# Altium schematic sheet power_io.SchDoc: Power & I/O
size A3; SheetNumber: 6; SheetTotal: 11
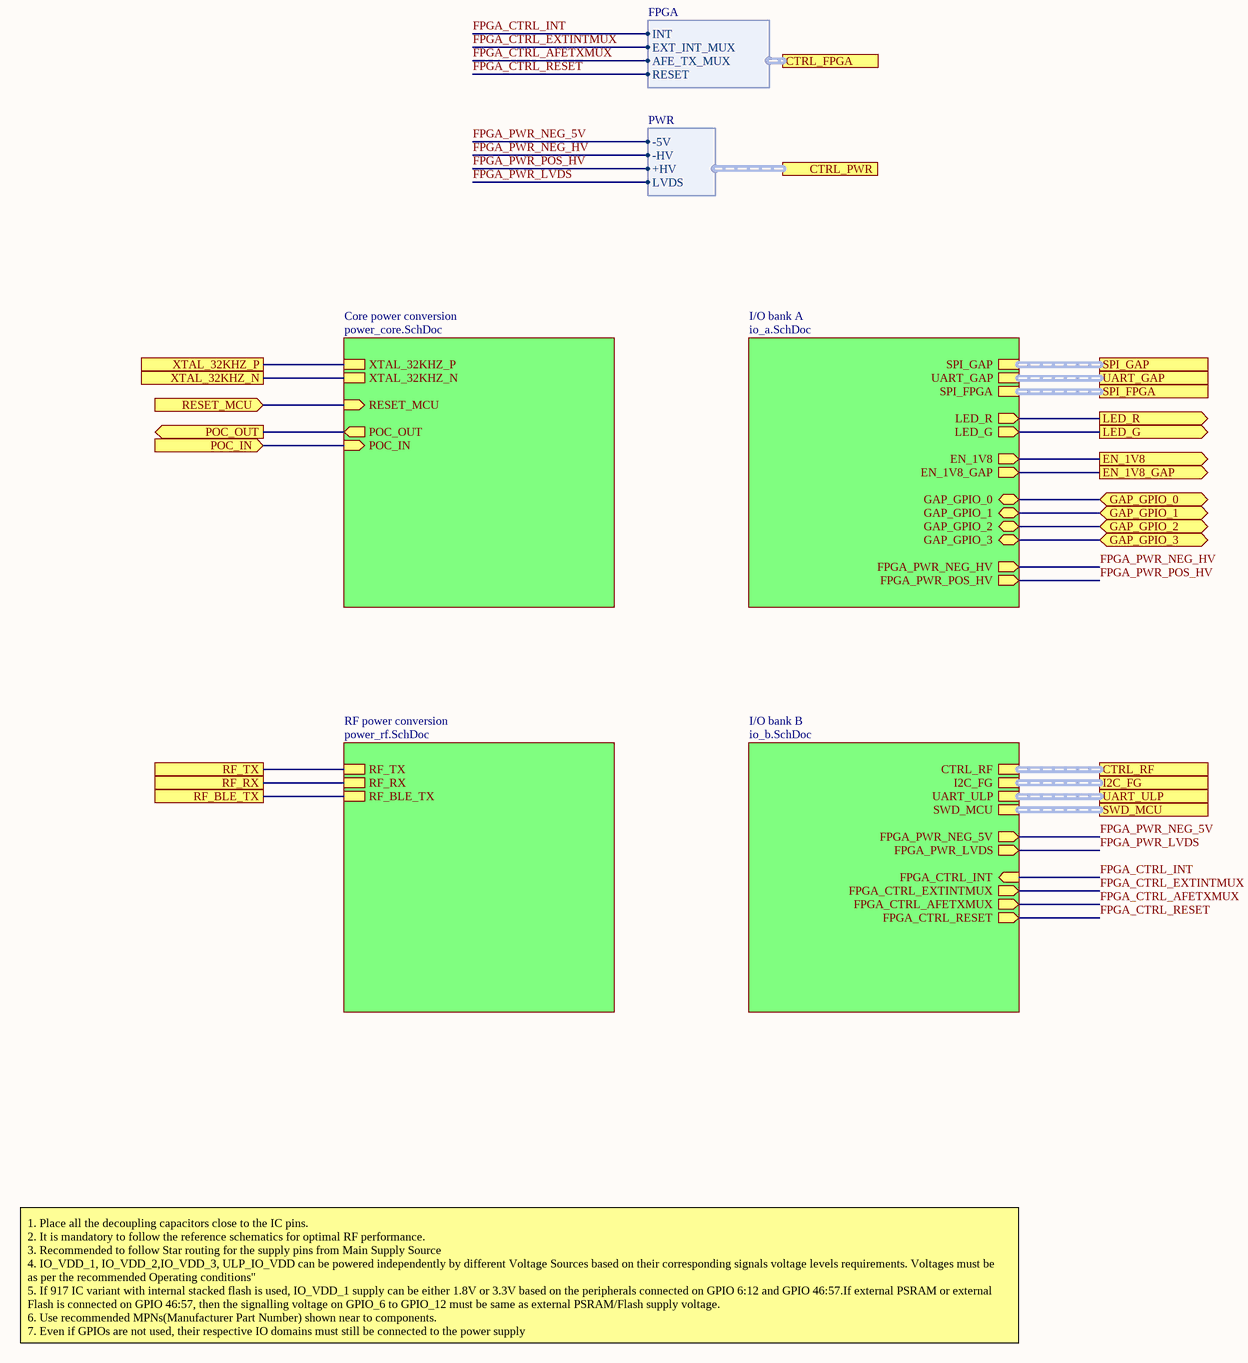
[diagram p0: power_io.SchDoc]

## Sub-sheets
Core power conversion = power_core.SchDoc: XTAL_32KHZ_P, XTAL_32KHZ_N, RESET_MCU (in), POC_OUT (out), POC_IN (in)
I/O bank A = io_a.SchDoc: SPI_GAP (harness SPI), UART_GAP (harness UART), SPI_FPGA (harness SPI), LED_R (out), LED_G (out), EN_1V8 (out), GAP_GPIO_0 (bidir), GAP_GPIO_1 (bidir), GAP_GPIO_2 (bidir), GAP_GPIO_3 (bidir), FPGA_PWR_NEG_HV (out), FPGA_PWR_POS_HV (out), EN_1V8_GAP (out)
I/O bank B = io_b.SchDoc: CTRL_RF (harness RF), I2C_FG (harness I2C), UART_ULP (harness UART), SWD_MCU (harness SWD), FPGA_CTRL_INT (in), FPGA_CTRL_EXTINTMUX (out), FPGA_CTRL_AFETXMUX (out), FPGA_CTRL_RESET (out), FPGA_PWR_NEG_5V (out), FPGA_PWR_LVDS (out)
RF power conversion = power_rf.SchDoc: RF_TX, RF_RX, RF_BLE_TX

## Ports
CTRL_FPGA (harness FPGA, see main[4B], connectors[4C]), CTRL_PWR (harness PWR, see main[4B], connectors[2C]), CTRL_RF (harness RF, see main[5A], io_b[4B], rf_clocks[1C]), EN_1V8 (out, see main[4C], io_a[3B], power_conversion[1B]), EN_1V8_GAP (out, see main[4C], io_a[3B]), GAP_GPIO_0 (bidir, see main[5B], gap[3C], io_a[3B]), GAP_GPIO_1 (bidir, see main[5B], gap[3C], io_a[3B]), GAP_GPIO_2 (bidir, see main[5B], gap[3C], io_a[3B]), GAP_GPIO_3 (bidir, see main[5B], gap[3C], io_a[3B]), I2C_FG (harness I2C, see main[4B], connectors[2B], io_b[4B], power_conversion[1A]), LED_G (out, see main[4B], debug_interface[1D], io_a[3A]), LED_R (out, see main[4A], debug_interface[1D], io_a[3A]), POC_IN (in, see main[4A], debug_interface[3B], power_core[1C]), POC_OUT (out, see main[4A], debug_interface[3A], power_core[1C]), RESET_MCU (in, see main[4A], debug_interface[1C], power_core[1C]), RF_BLE_TX (see main[5A], power_rf[4C], rf_clocks[4A]), RF_RX (see main[5A], power_rf[4B], rf_clocks[4B]), RF_TX (see main[5A], power_rf[4A], rf_clocks[4B]), SPI_FPGA (harness SPI, see main[4B], connectors[4B], io_a[3C]), SPI_GAP (harness SPI, see main[5B], gap[3C], io_a[3B]), SWD_MCU (harness SWD, see main[4A], debug_interface[3B], io_b[4C]), UART_GAP (harness UART, see main[5B], gap[1C], io_a[3B]), UART_ULP (harness UART, see main[4A], debug_interface[3B], io_b[4C]), XTAL_32KHZ_N (see main[5A], power_core[1C], rf_clocks[2B]), XTAL_32KHZ_P (see main[5A], power_core[1C], rf_clocks[1B])

## Harnesses
PWR: -5V, -HV, +HV, LVDS
FPGA: INT, EXT_INT_MUX, AFE_TX_MUX, RESET

## Nets
EN_1V8: port EN_1V8, sheet I/O bank A/EN_1V8
EN_1V8_GAP: port EN_1V8_GAP, sheet I/O bank A/EN_1V8_GAP
FPGA_CTRL_AFETXMUX: sheet I/O bank B/FPGA_CTRL_AFETXMUX, port CTRL_FPGA.AFE_TX_MUX
FPGA_CTRL_EXTINTMUX: sheet I/O bank B/FPGA_CTRL_EXTINTMUX, port CTRL_FPGA.EXT_INT_MUX
FPGA_CTRL_INT: sheet I/O bank B/FPGA_CTRL_INT, port CTRL_FPGA.INT
FPGA_CTRL_RESET: sheet I/O bank B/FPGA_CTRL_RESET, port CTRL_FPGA.RESET
FPGA_PWR_LVDS: sheet I/O bank B/FPGA_PWR_LVDS, port CTRL_PWR.LVDS
FPGA_PWR_NEG_5V: sheet I/O bank B/FPGA_PWR_NEG_5V, port CTRL_PWR.-5V
FPGA_PWR_NEG_HV: sheet I/O bank A/FPGA_PWR_NEG_HV, port CTRL_PWR.-HV
FPGA_PWR_POS_HV: sheet I/O bank A/FPGA_PWR_POS_HV, port CTRL_PWR.+HV
GAP_GPIO_0: port GAP_GPIO_0, sheet I/O bank A/GAP_GPIO_0
GAP_GPIO_1: port GAP_GPIO_1, sheet I/O bank A/GAP_GPIO_1
GAP_GPIO_2: port GAP_GPIO_2, sheet I/O bank A/GAP_GPIO_2
GAP_GPIO_3: port GAP_GPIO_3, sheet I/O bank A/GAP_GPIO_3
LED_G: port LED_G, sheet I/O bank A/LED_G
LED_R: port LED_R, sheet I/O bank A/LED_R
POC_IN: port POC_IN, sheet Core power conversion/POC_IN
POC_OUT: port POC_OUT, sheet Core power conversion/POC_OUT
RESET_MCU: port RESET_MCU, sheet Core power conversion/RESET_MCU
RF_BLE_TX: port RF_BLE_TX, sheet RF power conversion/RF_BLE_TX
RF_RX: port RF_RX, sheet RF power conversion/RF_RX
RF_TX: port RF_TX, sheet RF power conversion/RF_TX
XTAL_32KHZ_N: port XTAL_32KHZ_N, sheet Core power conversion/XTAL_32KHZ_N
XTAL_32KHZ_P: port XTAL_32KHZ_P, sheet Core power conversion/XTAL_32KHZ_P

## Buses and harness runs
harness port CTRL_RF = sheet I/O bank B/CTRL_RF
harness port I2C_FG = sheet I/O bank B/I2C_FG
harness port SPI_FPGA = sheet I/O bank A/SPI_FPGA
harness port SPI_GAP = sheet I/O bank A/SPI_GAP
harness port SWD_MCU = sheet I/O bank B/SWD_MCU
harness port UART_GAP = sheet I/O bank A/UART_GAP
harness port UART_ULP = sheet I/O bank B/UART_ULP

## Notes on the sheet
- 1. Place all the decoupling capacitors close to the IC pins.
  2. It is mandatory to follow the reference schematics for optimal RF performance.
  3. Recommended to follow Star routing for the supply pins from Main Supply Source
  4. IO_VDD_1, IO_VDD_2,IO_VDD_3, ULP_IO_VDD can be powered independently by different Voltage Sources based on their corresponding signals voltage levels requirements. Voltages must be
  as per the recommended Operating conditions"
  5. If 917 IC variant with internal stacked flash is used, IO_VDD_1 supply can be either 1.8V or 3.3V based on the peripherals connected on GPIO 6:12 and GPIO 46:57.If external PSRAM or external
  Flash is connected on GPIO 46:57, then the signalling voltage on GPIO_6 to GPIO_12 must be same as external PSRAM/Flash supply voltage.
  6. Use recommended MPNs(Manufacturer Part Number) shown near to components.
  7. Even if GPIOs are not used, their respective IO domains must still be connected to the power supply
- Project:
- Laboratory:
- Date:
- File:
- Rev:
- Variation:
- Drawn By:
- Checked By:
- Sheet:
- /